# Altium schematic sheet Input.SchDoc
size A4
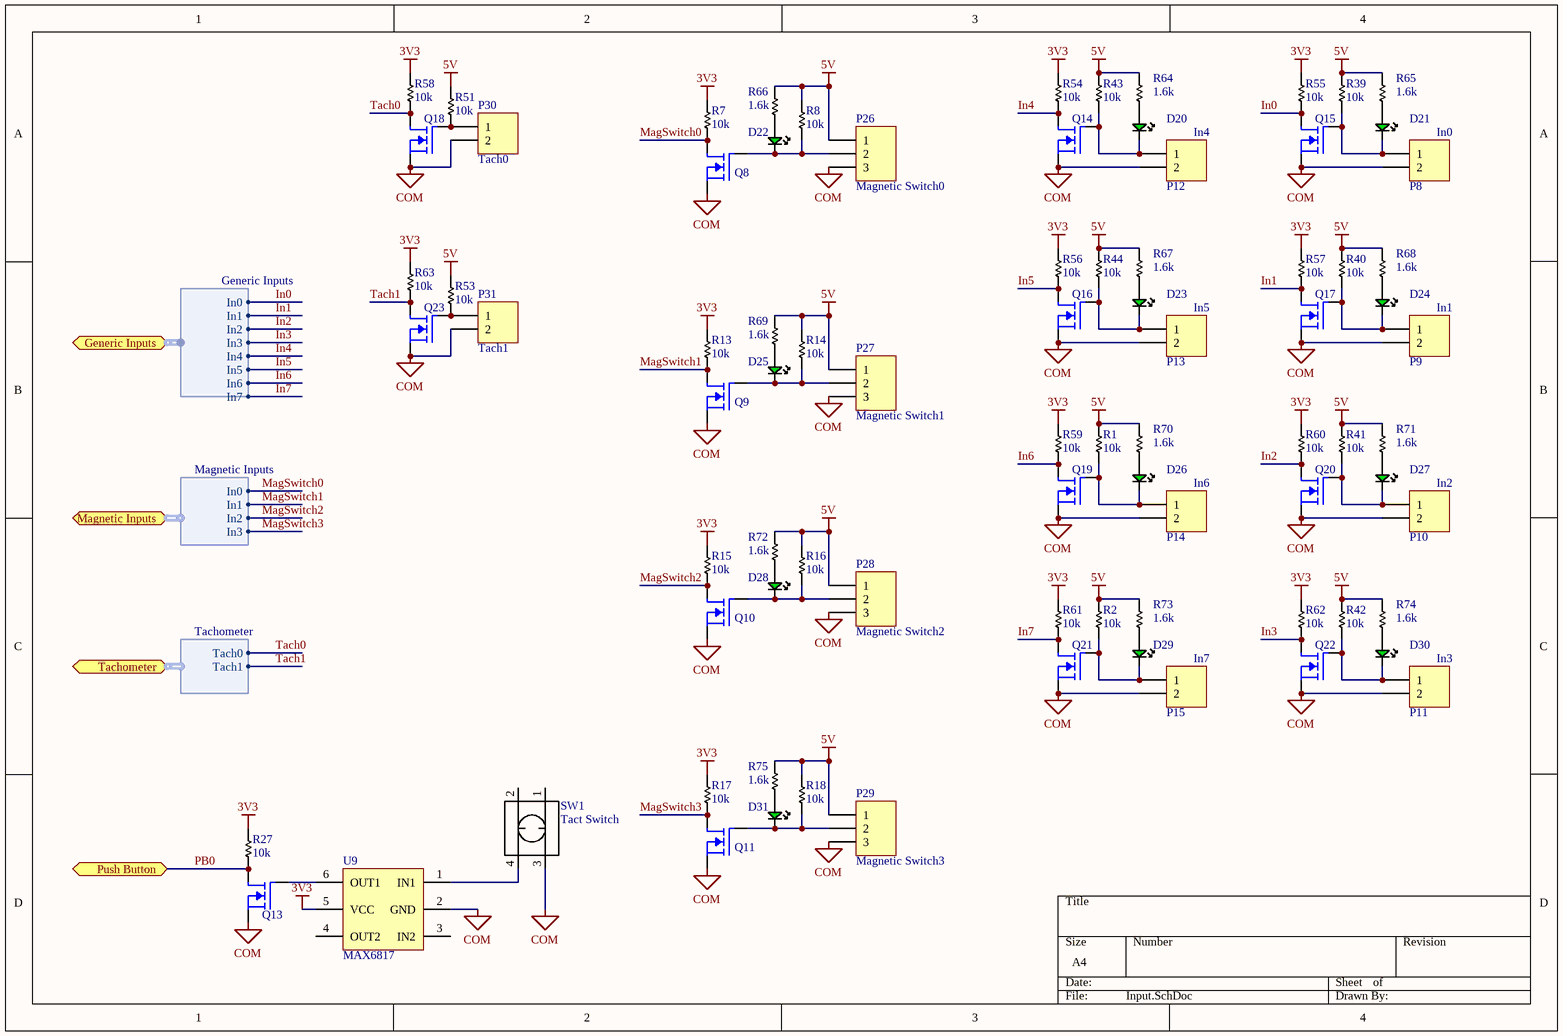
[diagram p0: Input.SchDoc]

## Parts
D20  Green  [0603 - Led Green]  (value not drawn)
D21  Green  [0603 - Led Green]  (value not drawn)
D22  Green  [0603 - Led Green]  (value not drawn)
D23  Green  [0603 - Led Green]  (value not drawn)
D24  Green  [0603 - Led Green]  (value not drawn)
D25  Green  [0603 - Led Green]  (value not drawn)
D26  Green  [0603 - Led Green]  (value not drawn)
D27  Green  [0603 - Led Green]  (value not drawn)
D28  Green  [0603 - Led Green]  (value not drawn)
D29  Green  [0603 - Led Green]  (value not drawn)
D30  Green  [0603 - Led Green]  (value not drawn)
D31  Green  [0603 - Led Green]  (value not drawn)
P8  In0  [Headers - 1x2 - Vertical - Lock]
P9  In1  [Headers - 1x2 - Vertical - Lock]
P10  In2  [Headers - 1x2 - Vertical - Lock]
P11  In3  [Headers - 1x2 - Vertical - Lock]
P12  In4  [Headers - 1x2 - Vertical - Lock]
P13  In5  [Headers - 1x2 - Vertical - Lock]
P14  In6  [Headers - 1x2 - Vertical - Lock]
P15  In7  [Headers - 1x2 - Vertical - Lock]
P26  Magnetic Switch0  [Headers - 1x3 - Vertical - Lock]
P27  Magnetic Switch1  [Headers - 1x3 - Vertical - Lock]
P28  Magnetic Switch2  [Headers - 1x3 - Vertical - Lock]
P29  Magnetic Switch3  [Headers - 1x3 - Vertical - Lock]
P30  Tach0  [Headers - 1x2 - Vertical - Lock]
P31  Tach1  [Headers - 1x2 - Vertical - Lock]
Q8  MOSFET_N  [SOT23-3]  (value not drawn)
Q9  MOSFET_N  [SOT23-3]  (value not drawn)
Q10  MOSFET_N  [SOT23-3]  (value not drawn)
Q11  MOSFET_N  [SOT23-3]  (value not drawn)
Q13  MOSFET_N  [SOT23-3]  (value not drawn)
Q14  MOSFET_N  [SOT23-3]  (value not drawn)
Q15  MOSFET_N  [SOT23-3]  (value not drawn)
Q16  MOSFET_N  [SOT23-3]  (value not drawn)
Q17  MOSFET_N  [SOT23-3]  (value not drawn)
Q18  MOSFET_N  [SOT23-3]  (value not drawn)
Q19  MOSFET_N  [SOT23-3]  (value not drawn)
Q20  MOSFET_N  [SOT23-3]  (value not drawn)
Q21  MOSFET_N  [SOT23-3]  (value not drawn)
Q22  MOSFET_N  [SOT23-3]  (value not drawn)
Q23  MOSFET_N  [SOT23-3]  (value not drawn)
R1  value 10k  [0805 - Resistor]  (hidden comment: Res)
R2  value 10k  [0805 - Resistor]  (hidden comment: Res)
R7  value 10k  [0805 - Resistor]  (hidden comment: Res)
R8  value 10k  [0805 - Resistor]  (hidden comment: Res)
R13  value 10k  [0805 - Resistor]  (hidden comment: Res)
R14  value 10k  [0805 - Resistor]  (hidden comment: Res)
R15  value 10k  [0805 - Resistor]  (hidden comment: Res)
R16  value 10k  [0805 - Resistor]  (hidden comment: Res)
R17  value 10k  [0805 - Resistor]  (hidden comment: Res)
R18  value 10k  [0805 - Resistor]  (hidden comment: Res)
R27  value 10k  [0805 - Resistor]  (hidden comment: Res)
R39  value 10k  [0805 - Resistor]  (hidden comment: Res)
R40  value 10k  [0805 - Resistor]  (hidden comment: Res)
R41  value 10k  [0805 - Resistor]  (hidden comment: Res)
R42  value 10k  [0805 - Resistor]  (hidden comment: Res)
R43  value 10k  [0805 - Resistor]  (hidden comment: Res)
R44  value 10k  [0805 - Resistor]  (hidden comment: Res)
R51  value 10k  [0805 - Resistor]  (hidden comment: Res)
R53  value 10k  [0805 - Resistor]  (hidden comment: Res)
R54  value 10k  [0805 - Resistor]  (hidden comment: Res)
R55  value 10k  [0805 - Resistor]  (hidden comment: Res)
R56  value 10k  [0805 - Resistor]  (hidden comment: Res)
R57  value 10k  [0805 - Resistor]  (hidden comment: Res)
R58  value 10k  [0805 - Resistor]  (hidden comment: Res)
R59  value 10k  [0805 - Resistor]  (hidden comment: Res)
R60  value 10k  [0805 - Resistor]  (hidden comment: Res)
R61  value 10k  [0805 - Resistor]  (hidden comment: Res)
R62  value 10k  [0805 - Resistor]  (hidden comment: Res)
R63  value 10k  [0805 - Resistor]  (hidden comment: Res)
R64  value 1.6k  [0805 - Resistor]  (hidden comment: Res)
R65  value 1.6k  [0805 - Resistor]  (hidden comment: Res)
R66  value 1.6k  [0805 - Resistor]  (hidden comment: Res)
R67  value 1.6k  [0805 - Resistor]  (hidden comment: Res)
R68  value 1.6k  [0805 - Resistor]  (hidden comment: Res)
R69  value 1.6k  [0805 - Resistor]  (hidden comment: Res)
R70  value 1.6k  [0805 - Resistor]  (hidden comment: Res)
R71  value 1.6k  [0805 - Resistor]  (hidden comment: Res)
R72  value 1.6k  [0805 - Resistor]  (hidden comment: Res)
R73  value 1.6k  [0805 - Resistor]  (hidden comment: Res)
R74  value 1.6k  [0805 - Resistor]  (hidden comment: Res)
R75  value 1.6k  [0805 - Resistor]  (hidden comment: Res)
SW1  Tact Switch  [TE FSMJSMA]
U9  MAX6817  [SOT23-6]

## Ports
Generic Inputs (harness Generic Inputs), Magnetic Inputs (harness Magnetic Inputs), Push Button, Tachometer (harness Tachometer)

## Harnesses
Generic Inputs: In0, In1, In2, In3, In4, In5, In6, In7
Magnetic Inputs: In0, In1, In2, In3
Tachometer: Tach0, Tach1

## Nets
3V3: R7.2 R13.2 R15.2 R17.2 R27.2 R54.2 R55.2 R56.2 R57.2 R58.2 R59.2 R60.2 R61.2 R62.2 R63.2 U9.5(VCC)
5V: P26.1 P27.1 P28.1 P29.1 R1.2 R2.2 R8.2 R14.2 R16.2 R18.2 R39.2 R40.2 R41.2 R42.2 R43.2 R44.2 R51.2 R53.2 R64.2 R65.2 R66.2 R67.2 R68.2 R69.2 R70.2 R71.2 R72.2 R73.2 R74.2 R75.2
COM: P8.2 P9.2 P10.2 P11.2 P12.2 P13.2 P14.2 P15.2 P26.3 P27.3 P28.3 P29.3 P30.2 P31.2 Q8.2(S) Q9.2(S) Q10.2(S) Q11.2(S) Q13.2(S) Q14.2(S) Q15.2(S) Q16.2(S) Q17.2(S) Q18.2(S) Q19.2(S) Q20.2(S) Q21.2(S) Q22.2(S) Q23.2(S) SW1.3 U9.2(GND)
In0: Q15.3(D) R55.1 ; port Generic Inputs.In0
In1: Q17.3(D) R57.1 ; port Generic Inputs.In1
In2: Q20.3(D) R60.1 ; port Generic Inputs.In2
In3: Q22.3(D) R62.1 ; port Generic Inputs.In3
In4: Q14.3(D) R54.1 ; port Generic Inputs.In4
In5: Q16.3(D) R56.1 ; port Generic Inputs.In5
In6: Q19.3(D) R59.1 ; port Generic Inputs.In6
In7: Q21.3(D) R61.1 ; port Generic Inputs.In7
MagSwitch0: Q8.3(D) R7.1 ; port Magnetic Inputs.In0
MagSwitch1: Q9.3(D) R13.1 ; port Magnetic Inputs.In1
MagSwitch2: Q10.3(D) R15.1 ; port Magnetic Inputs.In2
MagSwitch3: Q11.3(D) R17.1 ; port Magnetic Inputs.In3
PB0: Q13.3(D) R27.1 ; port Push Button
Tach0: Q18.3(D) R58.1 ; port Tachometer.Tach0
Tach1: Q23.3(D) R63.1 ; port Tachometer.Tach1
NetD20_1: D20.1(A) R64.1
NetD20_2: D20.2(K) P12.1 Q14.1(G) R43.1
NetD21_1: D21.1(A) R65.1
NetD21_2: D21.2(K) P8.1 Q15.1(G) R39.1
NetD22_1: D22.1(A) R66.1
NetD22_2: D22.2(K) P26.2 Q8.1(G) R8.1
NetD23_1: D23.1(A) R67.1
NetD23_2: D23.2(K) P13.1 Q16.1(G) R44.1
NetD24_1: D24.1(A) R68.1
NetD24_2: D24.2(K) P9.1 Q17.1(G) R40.1
NetD25_1: D25.1(A) R69.1
NetD25_2: D25.2(K) P27.2 Q9.1(G) R14.1
NetD26_1: D26.1(A) R70.1
NetD26_2: D26.2(K) P14.1 Q19.1(G) R1.1
NetD27_1: D27.1(A) R71.1
NetD27_2: D27.2(K) P10.1 Q20.1(G) R41.1
NetD28_1: D28.1(A) R72.1
NetD28_2: D28.2(K) P28.2 Q10.1(G) R16.1
NetD29_1: D29.1(A) R73.1
NetD29_2: D29.2(K) P15.1 Q21.1(G) R2.1
NetD30_1: D30.1(A) R74.1
NetD30_2: D30.2(K) P11.1 Q22.1(G) R42.1
NetD31_1: D31.1(A) R75.1
NetD31_2: D31.2(K) P29.2 Q11.1(G) R18.1
NetP30_1: P30.1 Q18.1(G) R51.1
NetP31_1: P31.1 Q23.1(G) R53.1
NetQ13_1: Q13.1(G) U9.6(OUT1)
NetSW1_4: SW1.4 U9.1(IN1)

Not connected (* = marked no-connect by the designer): SW1 1 2; U9 3(IN2) 4(OUT2)

## Library data of the parts
D20-D31 = LED-Green-2mA-lowBrigthness-0603: LED SMARTLED GREEN 570NM 0603; Manufacturer: OSRAM Opto Semiconductor; Manufacturer No: LG L29K-G2J1-24-Z; Sub Category: 0603; Value: 3.92 mcd; Voltage: 1.7V; Current: 2mA; Part Number: LED-Green-2mA-lowBrigthness-0603; Category: LED; Pin count: 2; Package: 0603; Series: SmartLED; Supplier 1: Digi-Key; Supplier Part Number 1: 475-2709-1-ND; ComponentLink1URL: http://catalog.osram-os.com/catalogue/catalogue.do;jsessionid=32CB61882C089EDD4B6D0A54E7E1F117?act=downloadFile&favOid=020000020000138e000100b6; ComponentLink1Description: Datasheet; Creation Date: 2013-11-17 11:13:55; Created by: Pier-Yves; Height: 0.65mm
P8-P15 P30 P31 = Header-0.100-Vertical-Lock-1X2: CONN HEADER 2POS .100" STR TIN; Manufacturer: Molex Inc; Manufacturer No: 0901361102; Sub Category: 100mils Vertical lock; Value: 2 pins; LatestRevisionDate: 17-Jul-2002; LatestRevisionNote: Re-released for DXP Platform.; Publisher: Altium Limited; Part Number: Header-0.100-Vertical-Lock-1X2; Category: Header; Pin count: 2; Series: C-Grid III 90136; Supplier 1: Digi-Key; Supplier Part Number 1: WM8213-ND; ComponentLink1URL: http://www.molex.com/pdm_docs/sd/901361102_sd.pdf; ComponentLink1Description: Datasheet; Creation Date: 2013-11-05 17:17:54; Created by: Pier-Yves; Height: 10.9mm
P26-P29 = Header-0.100-Vertical-Lock-1X3: CONN HEADER 3POS .100" STR TIN; Manufacturer: Molex Inc; Manufacturer No: 0901361103; Sub Category: 100mils Vertical lock; Value: 3 pins; LatestRevisionDate: 17-Jul-2002; LatestRevisionNote: Re-released for DXP Platform.; Publisher: Altium Limited; Part Number: Header-0.100-Vertical-Lock-1X3; Category: Header; Pin count: 3; Series: C-Grid III 90136; Supplier 1: Digi-Key; Supplier Part Number 1: WM8214-ND; ComponentLink1URL: http://www.molex.com/pdm_docs/sd/901361103_sd.pdf; ComponentLink1Description: Datasheet; Creation Date: 2013-11-05 17:17:54; Created by: Pier-Yves; Height: 10.9mm
Q8-Q11 Q13-Q23 = 2N7002: MosFET Channel-N SOT-23-3 3.3A; Part Number: 2N7002; Manufacturer: Vishay Siliconix; Manufacturer No: SI2304DDS-T1-GE3; Sub Category: MOSFET-N; Value: Channel N; Power: 1.7W; Voltage: 30V; Category: Transistor; Pin count: 3; Package: SOT-23-3; Series: ÉTrenchFET; Supplier 1: Digi-Key; Supplier Part Number 1: SI2304DDS-T1-GE3CT-ND; ComponentLink1URL: http://www.vishay.com/docs/65175/si2304dd.pdf; ComponentLink1Description: Datasheet; Creation Date: 2013-06-28 13:51:31; Created by: Pier-Yves; Current: 3.3A
R1 R2 R7 R8 R13-R18 R27 R39-R44 R51 R53-R63 = Yagao-RC0805-10k: RES 10K OHM 1/8W 5% 0805 SMD; Manufacturer: Yagao; Manufacturer No: RC0805JR-0710KL; Sub Category: 0805; Part Number: Yagao-RC0805-10k; Category: Resistor; Pin count: 2; Package: 0805; Series: RC0805; Supplier 1: Digi-Key; Supplier Part Number 1: 311-10KARCT-ND; ComponentLink1URL: http://media.digikey.com/pdf/Data%20Sheets/Yageo%20PDFs/RC0805%20Pb%20Free.pdf; ComponentLink1Description: Datasheet; Creation Date: 2013-06-28 03:21:03; Created by: Pier-Yves; Tolerance: 5%; Power: 1/8W; Height: 0.6mm
R64-R75 = Yagao-RC0805-1.6k: RES 1.6K OHM 1/8W 5% 0805 SMD; Manufacturer: Yagao; Manufacturer No: RC0805JR-071K6L; Sub Category: 0805; Part Number: Yagao-RC0805-1.6k; Category: Resistor; Pin count: 2; Package: 0805; Series: RC0805; Supplier 1: Digi-Key; Supplier Part Number 1: 311-1.6KARCT-ND; ComponentLink1URL: http://media.digikey.com/pdf/Data%20Sheets/Yageo%20PDFs/RC0805%20Pb%20Free.pdf; ComponentLink1Description: Datasheet; Creation Date: 2013-06-28 03:21:03; Created by: Pier-Yves; Tolerance: 5%; Power: 1/8W; Height: 0.6mm
SW1 = TactSwitch-SMD-Vertical-GullWing-6x6: SWITCH TACTILE SPST-NO 0.05A 12V; Manufacturer: TE Connectivity; Manufacturer No: FSM4JSMATR; Current: 50mA; Part Number: TactSwitch-SMD-Vertical-GullWing-6x6; Category: Switch; Sub Category: Tactile; Pin count: 4; Series: FSMJSMA, Alcoswitch; Supplier 1: Digi-Key; Supplier Part Number 1: 450-1759-1-ND; ComponentLink1URL: http://media.digikey.com/pdf/Data%20Sheets/Tyco%20Electronics%20Alcoswitch%20PDFs/FSM%20Series.pdf; ComponentLink1Description: Datasheet; Creation Date: 2013-10-09 16:09:19; Created by: Pier-Yves; Height: 5mm; Temperature: -35°C ~ 85°C
U9 = MAX6817: IC DEBOUNCER SWITCH DUAL SOT23-6; Manufacturer: Maxim Integrated; Manufacturer No: MAX6817EUT+T; Value: 2 Channels; Part Number: MAX6817; Category: IC; Sub Category: Debouncer; Pin count: 6; Package: SOT-23-6; Supplier 1: Digi-Key; Supplier Part Number 1: MAX6817EUT+TCT-ND; ComponentLink1URL: http://datasheets.maximintegrated.com/en/ds/MAX6816-MAX6818.pdf; ComponentLink1Description: Datasheet; Creation Date: 2013-10-01 12:52:13; Created by: Pier-Yves; Temperature: 2.7 V ~ 5.5 V